# Altium project PCB-Tester-Board-V1.PrjPcb (part 3 of 4)

## Sheet X7A15T-Prog.SchDoc: PCB-Tester X7A15T-Prog
size A4; Organization: Test Engineering; Address1: Hans-Bunte-Strasse 19; Address2: D-79108 Freiburg; Address3: Germany; DocumentNumber: U33110; Revision: V1.0; SheetNumber: 12; SheetTotal: 20; Date: JUN 2020; CheckedBy: Moerz, Hoeren; Author: Rudziński; CompanyName: TDK-Micronas GmbH; DrawnBy: Rudziński; Engineer: Rudziński; DateDraw: JUN 2020; DateChecked: 2020-06-19; PageSetup: Record=PageOptions|CenterHorizontal=True|CenterVertical=True|PrintScale=0.97|XCorrection=1.00|YCorrection=1.00|PrintKind=0|BorderSize=5000000|LeftOffset=0|BottomOffset=0|Orientation=2|PaperLength=1000|PaperWidth=1000|Scale=100|PaperSource=7|PrintQuality=-3|MediaType=1|DitherType=10|PrintScaleMode=1|PaperKind=A4|PaperIndex=9; TitleTyp: Title-Typ; Block: CPU & SCT8; Workspace: Workspace
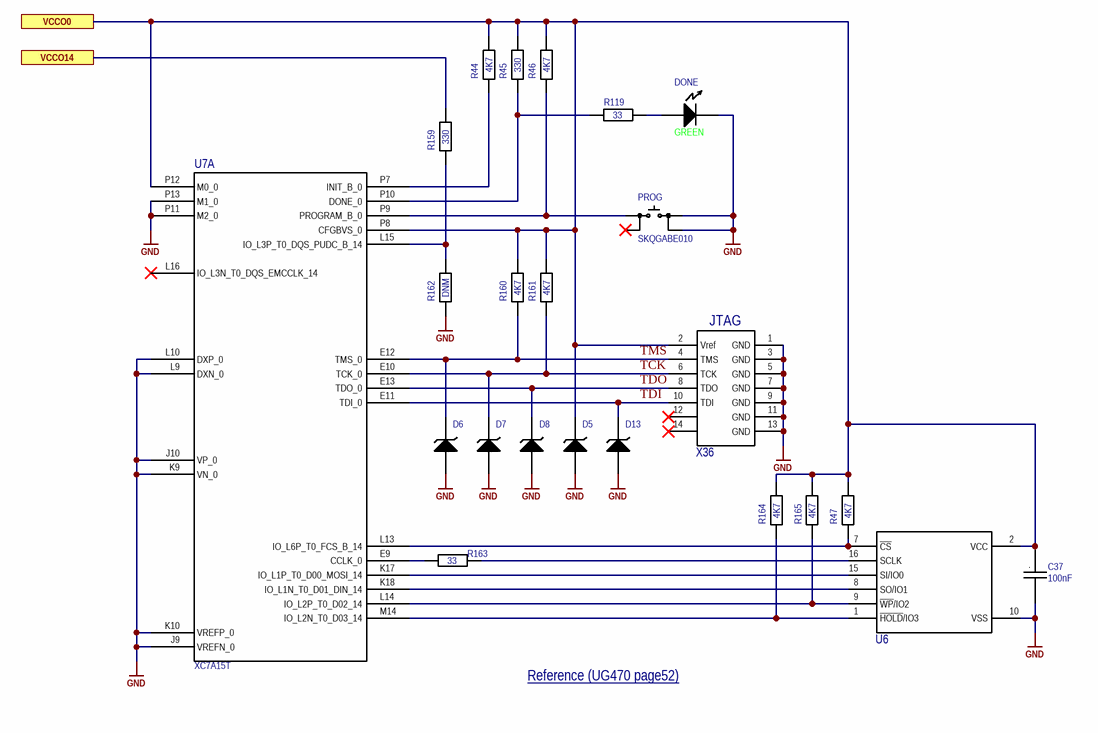
[diagram p10: X7A15T-Prog.SchDoc]

### Parts
C37  value 100nF  [C0402 Reflow]  (hidden comment: C)
D5  D  [SOD323]  (value not drawn)
D6  D  [SOD323]  (value not drawn)
D7  D  [SOD323]  (value not drawn)
D8  D  [SOD323]  (value not drawn)
D13  D  [SOD323]  (value not drawn)
DONE  Color: GREEN  [L0603G]  (hidden comment: D)
PROG  SKQGABE010  [SKQGABE010]
R44  value 4K7  [R0402 Reflow]  (hidden comment: R)
R45  value 330  [R0402 Reflow]  (hidden comment: R)
R46  value 4K7  [R0402 Reflow]  (hidden comment: R)
R47  value 4K7  [R0402 Reflow]  (hidden comment: R)
R119  value 33  [R0402 Reflow]  (hidden comment: R)
R159  value 330  [R0402 Reflow]  (hidden comment: R)
R160  value 4K7  [R0402 Reflow]  (hidden comment: R)
R161  value 4K7  [R0402 Reflow]  (hidden comment: R)
R162  value DNM  [R0402 Reflow]  (hidden comment: R)  (no BOM)
R163  value 33  [R0402 Reflow]  (hidden comment: R)
R164  value 4K7  [R0402 Reflow]  (hidden comment: R)
R165  value 4K7  [R0402 Reflow]  (hidden comment: R)
U6  U  [SOICW-16]  (value not drawn)
U7  NicName: XC7A15T  [XC7A15T-1CSG324C]  (hidden comment: U)  (part A of 8)
X36  NickName: JTAG  [LTMM-107-02-F-D]  (hidden comment: X)

### Ports
VCCO0, VCCO14

### Nets
3V3: C37.1 D5.2(C) R44.2 R45.2 R46.2 R47.2 R159.2 R160.2 R161.2 R164.2 R165.2 U6.2(VCC) U7.P8(CFGBVS_0) U7.P12(M0_0) X36.2(Vref) ; port VCCO0, port VCCO14
GND: C37.2 D5.1(A) D6.1(A) D7.1(A) D8.1(A) D13.1(A) DONE.2(Cathode) PROG.3 PROG.4 R162.1 U6.10(VSS) U7.J9(VREFN_0) U7.J10(VP_0) U7.K9(VN_0) U7.K10(VREFP_0) U7.L9(DXN_0) U7.L10(DXP_0) U7.P11(M2_0) U7.P13(M1_0) X36.1(GND) X36.3(GND) X36.5(GND) X36.7(GND) X36.9(GND) X36.11(GND) X36.13(GND)
TCK: D7.2(C) R161.1 U7.E10(TCK_0) X36.6(TCK)  [project net TCK_12]
TDI: D13.2(C) U7.E11(TDI_0) X36.10(TDI)  [project net TDI_12]
TDO: D8.2(C) U7.E13(TDO_0) X36.8(TDO)  [project net TDO_12]
TMS: D6.2(C) R160.1 U7.E12(TMS_0) X36.4(TMS)  [project net TMS_12]
NetDONE_1: DONE.1(Anode) R119.2
NetPROG_1: PROG.1 R46.1 U7.P9(PROGRAM_B_0)
NetR44_1: R44.1 U7.P7(INIT_B_0)
NetR45_1: R45.1 R119.1 U7.P10(DONE_0)
NetR47_1: R47.1 U6.7(~{CS}) U7.L13(IO_L6P_T0_FCS_B_14)
NetR159_1: R159.1 R162.2 U7.L15(IO_L3P_T0_DQS_PUDC_B_14)
NetR163_1: R163.1 U7.E9(CCLK_0)
NetR163_2: R163.2 U6.16(SCLK)
NetR164_1: R164.1 U6.1(~{HOLD}/IO3) U7.M14(IO_L2N_T0_D03_14)
NetR165_1: R165.1 U6.9(~{WP}/IO2) U7.L14(IO_L2P_T0_D02_14)
NetU6_8: U6.8(SO/IO1) U7.K18(IO_L1N_T0_D01_DIN_14)
NetU6_15: U6.15(SI/IO0) U7.K17(IO_L1P_T0_D00_MOSI_14)

Not connected (* = marked no-connect by the designer): PROG 2*; U7 L16(IO_L3N_T0_DQS_EMCCLK_14)*; X36 12* 14*

### Notes on the sheet
- Reference (UG470 page52) <https://www.xilinx.com/support/documentation/user_guides/ug470_7Series_Config.pdf>
- designed by
- reviewed by
- last drawn by
- Project:
- Schematic:
- last printed
- DIN-A4 L
- sheets
- of
- File:
- (in symbol C) .

### Library data of the parts
C37 = C: CAP CER 0.1UF 25V X7R 0402; 04. Manufacturer: Yageo; 07. Manufacturer  Part Number: CC0402KRX7R8BB104; Tolerance: ±5%; Voltage Rating: 16V; 03. Unit Price: 0.09; 13. Created Date/Name: AUG2018/Hören; Type: X7R; ComponentLink1Description: Info; ComponentLink1URL: https://www.digikey.de/product-detail/en/kemet/C0402C104J4RACTU/399-7761-6-ND/3472292; 02. Distributor Part Number: 311-2077-6-ND; 09. Operating Temperature: -55°C ~ 125°C; 11. RoHS: YES; 01. Distributor: DigiKey; ComponentLink2Description: DataSheet; ComponentLink2URL: https://content.kemet.com/datasheets/KEM_C1002_X7R_SMD.pdf; Package: 0402
D5-D8 D13 = UCLAMP3301D.TCT: TVS DIODE 3.3V 9.5V SOD323; 04. Manufacturer: Semtech Corporation; 03. Unit Price: 0.67; 01. Distributor: DigiKey; 02. Distributor Part Number: UCLAMP3301DCT-ND; 07. Manufacturer  Part Number: UCLAMP3301D.TCT; 11. RoHS: YES; ComponentLink1Description: Info; ComponentLink1URL: https://www.digikey.de/product-detail/en/nexperia-usa-inc/PMEG4050EP115/1727-5842-6-ND/2697559; ComponentLink2Description: DataSheet; ComponentLink2URL: https://assets.nexperia.com/documents/data-sheet/PMEG4050EP.pdf
DONE = LED: LED GREEN DIFFUSED 0603 SMD; 04. Manufacturer: OSRAM Opto Semiconductors Inc.; 07. Manufacturer  Part Number: LG L29K-G2J1-24-Z; Vf: 1.7V; If: 2mA; Wave Length: 570nm; Viewing Angle: 160°; 03. Unit Price: 0.4; 13. Created Date/Name: AUG2018/Hören; ComponentLink1Description: Info; ComponentLink1URL: https://www.digikey.de/products/en?keywords=475-2709-6-ND; ComponentLink2Description: DataSheet; ComponentLink2URL: https://www.digikey.de/products/en?keywords=475-2709-6-ND; 02. Distributor Part Number: 475-2709-6-ND; 11. RoHS: YES; 01. Distributor: DigiKey
PROG = PUSH_BTN: Tactile Switches 5.2x5.2x1.5mm 160gf; 04. Manufacturer: Alps; 03. Unit Price: 0.497; ComponentLink1URL: *; ComponentLink1Description: Info; 02. Distributor Part Number: 688-SKQGAB; 07. Manufacturer  Part Number: SKQGABE010; 11. RoHS: YES; 01. Distributor: Mouser; ComponentLink2Description: DataSheet; Value: SKQGABE010
R44 R46 R47 R160 R161 R164 R165 = R: RES SMD 4.7K OHM 1% 1/16W 0402; 04. Manufacturer: Yageo; 07. Manufacturer  Part Number: RC0402FR-074K7L; 03. Unit Price: 0.09; 13. Created Date/Name: AUG2018/Hören; Power Rating: 63mW; Tolerance: ±1%; ComponentLink1URL: https://www.digikey.de/products/en?keywords=311-4.7KLRDKR-ND; ComponentLink1Description: Info; 02. Distributor Part Number: 311-4.7KLRDKR-ND; 09. Operating Temperature: -55°C ~ 155°C; 11. RoHS: YES; 01. Distributor: DigiKey; ComponentLink2Description: DataSheet; Type: Thick Film; Package: 0402
R45 R159 R162 = R: RES SMD 330 OHM 1% 1/16W 0402; 04. Manufacturer: Yageo; 07. Manufacturer  Part Number: RC0402FR-07330RL; 03. Unit Price: 0.09; 13. Created Date/Name: AUG2018/Hören; Power Rating: 63mW; Tolerance: ±1%; ComponentLink1URL: https://www.digikey.de/products/en?keywords=311-330LRDKR-ND; ComponentLink1Description: Info; 02. Distributor Part Number: 311-330LRDKR-ND; 09. Operating Temperature: -55°C ~ 155°C; 11. RoHS: YES; 01. Distributor: DigiKey; ComponentLink2Description: DataSheet; Type: Thick Film; Package: 0402
R119 R163 = R_19: RES SMD 33 OHM 1% 1/16W 0402; 04. Manufacturer: Yageo; 07. Manufacturer  Part Number: RC0402FR-0733RL; 03. Unit Price: 0.09; 13. Created Date/Name: AUG2018/Hören; Power Rating: 63mW; Tolerance: ±1%; ComponentLink1URL: https://www.digikey.de/products/en?keywords=311-33.0LRDKR-ND; ComponentLink1Description: Info; 02. Distributor Part Number: 311-33.0LRDKR-ND; 09. Operating Temperature: -55°C ~ 155°C; 11. RoHS: YES; 01. Distributor: DigiKey; ComponentLink2Description: DataSheet; Type: Thick Film; Package: 0402
U6 = S25FL128SAGMFI000: IC FLASH 128M SPI 133MHZ 16SOIC; 04. Manufacturer: Cypress Semiconductor Corp; 03. Unit Price: 2.77; 01. Distributor: Digikey; 02. Distributor Part Number: 1274-1000-ND; 07. Manufacturer  Part Number: S25FL128SAGMFI000; ComponentLink2Description: DataSheet; NickName: S25FL128SAGMFI000
U7 = XC7A15T-CS324: XC7A15T-1CSG324C; MFR: XILINX; POPULATED: yes; 03. Unit Price: 20.65; MFR-PN: XC7A15T-CS324; 04. Manufacturer: XILINX; 07. Manufacturer  Part Number: XC7A15T-1CSG324C; 01. Distributor: Avnet; 02. Distributor Part Number: XC7A15T-1CSG324C; 09. Operating Temperature: 0°C ~ 85°C (TJ); 11. RoHS: YES; ComponentLink4Description: Info; ComponentLink4URL: https://www.digikey.de/products/en?keywords=XC7A15T-1CSG324C; ComponentLink5Description: DataSheet; ComponentLink5URL: https://www.xilinx.com/support/documentation/data_sheets/ds181_Artix_7_Data_Sheet.pdf; ComponentLink6Description: NXP; ComponentLink6URL: https://www.nxp.com/part/MK20DN512VMD10
X36 = LTMM-107-02-F-D: CONN HEADER VERT 14POS 2MM; 04. Manufacturer: Samtec Inc.; 03. Unit Price: 2.38; 13. Created Date/Name: ??? / Hören; System: Connector; 01. Distributor: DigiKey; 02. Distributor Part Number: LTMM-107-02-F-D-ND; 07. Manufacturer  Part Number: LTMM-107-02-F-D; 11. RoHS: YES; ComponentLink1Description: Info; ComponentLink1URL: https://www.digikey.de/product-detail/en/samtec-inc/LTMM-107-02-F-D/LTMM-107-02-F-D-ND/8723899; ComponentLink2Description: DataSheet; ComponentLink2URL: https://www.samtec.com/products/ltmm

## Sheet X7A15T-Fabric.SchDoc: PCB-Tester X7A15T-Fabric
size A3; Organization: Test Engineering; Address1: Hans-Bunte-Strasse 19; Address2: D-79108 Freiburg; Address3: Germany; DocumentNumber: U33110; Revision: V1.0; SheetNumber: 9; SheetTotal: 20; Date: JUN 2020; CheckedBy: Moerz, Hoeren; Author: Rudziński; CompanyName: TDK-Micronas GmbH; DrawnBy: Rudziński; Engineer: Rudziński; DateDraw: JUN 2020; DateChecked: 2020-06-19; PageSetup: Record=PageOptions|CenterHorizontal=True|CenterVertical=True|PrintScale=0.97|XCorrection=1.00|YCorrection=1.00|PrintKind=0|BorderSize=5000000|LeftOffset=0|BottomOffset=0|Orientation=2|PaperLength=1000|PaperWidth=1000|Scale=100|PaperSource=7|PrintQuality=-3|MediaType=1|DitherType=10|PrintScaleMode=1|PaperKind=A4|PaperIndex=9; TitleTyp: Title-Typ; Block: CPU & SCT8; Workspace: Workspace
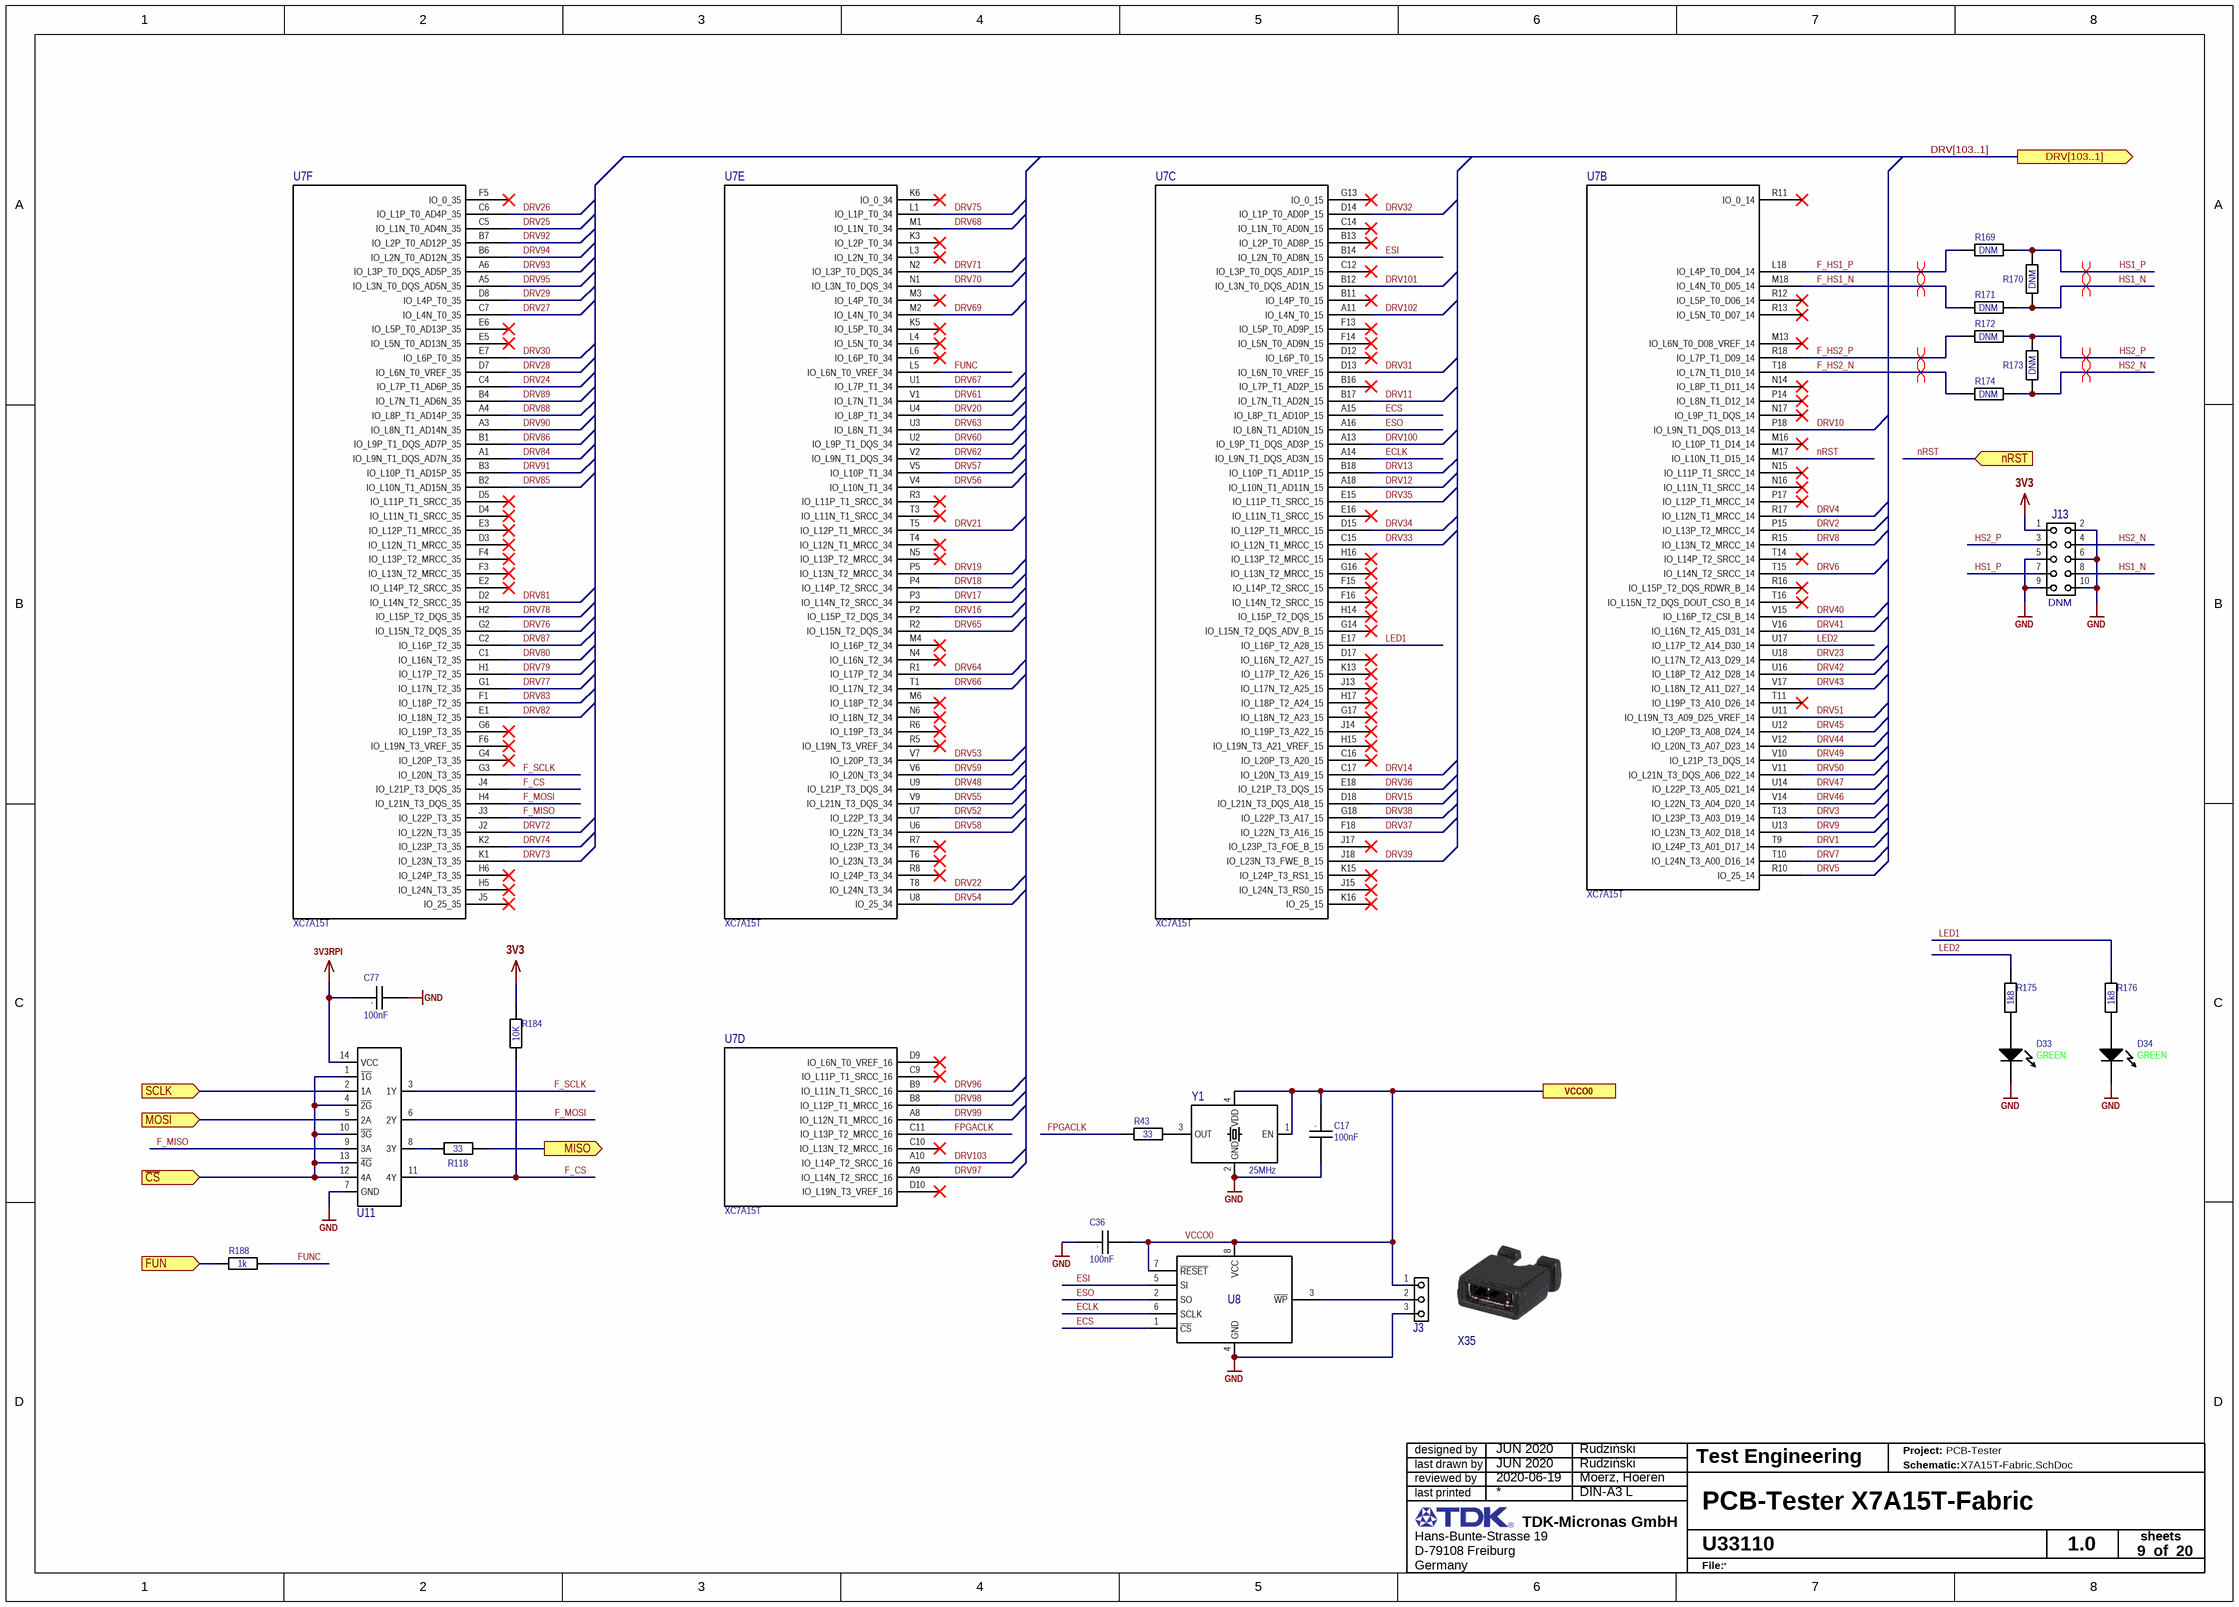
[diagram p11: X7A15T-Fabric.SchDoc]

### Parts
C17  value 100nF  [C0402 Reflow]  (hidden comment: C)
C36  value 100nF  [C0402 Reflow]  (hidden comment: C)
C77  value 100nF  [C0402 Reflow]  (hidden comment: C)
D33  Color: GREEN  [L0603G]  (hidden comment: D)
D34  Color: GREEN  [L0603G]  (hidden comment: D)
J3  J  [Header 100mil 3x1]  (value not drawn)
J13  NicName: DNM  [Header 100mil 5x2]  (hidden comment: J)  (no BOM)
R43  value 33  [R0402 Reflow]  (hidden comment: R)
R118  value 33  [R0402 Reflow]  (hidden comment: R)
R169  value DNM  [R0402 Reflow]  (hidden comment: R)  (no BOM)
R170  value DNM  [R0402 Reflow]  (hidden comment: R)  (no BOM)
R171  value DNM  [R0402 Reflow]  (hidden comment: R)  (no BOM)
R172  value DNM  [R0402 Reflow]  (hidden comment: R)  (no BOM)
R173  value DNM  [R0402 Reflow]  (hidden comment: R)  (no BOM)
R174  value DNM  [R0402 Reflow]  (hidden comment: R)  (no BOM)
R175  value 1k8  [R0603 Reflow]  (hidden comment: R)
R176  value 1k8  [R0603 Reflow]  (hidden comment: R)
R184  value 10K  [R0402 Reflow]  (hidden comment: R)
R188  value 1k  [R0402 Reflow]  (hidden comment: R)
U7  NicName: XC7A15T  [XC7A15T-1CSG324C]  (hidden comment: U)  (parts B,C,D,E,F of 8)
U8  U  [SOIC8 (R-8)]  (value not drawn)
U11  U  [TSSOP14]  (value not drawn)
X35  X  (value not drawn)
Y1  Frequency: 25MHz  [4SMD]  (hidden comment: Y)

### Ports
DRV[103..1] (out), FUN (in), MISO (out), MOSI (in), nRST (in), SCLK (in), VCCO0, ~{CS} (in)

### Nets
3V3: C17.1 C36.2 J3.1 J13.1 R184.2 U8.7(~{RESET}) U8.8(VCC) Y1.1(EN) Y1.4(VDD) ; port VCCO0  [also labelled VCCO0]
3V3RPI: C77.1 U11.14(VCC)
GND: C17.2 C36.1 C77.2 D33.2(Cathode) D34.2(Cathode) J3.3 J13.2 J13.5 J13.6 J13.9 J13.10 U8.4(GND) U11.7(GND) Y1.2(GND)
~{CS1}: U11.1(~{1G}) U11.4(~{2G}) U11.10(~{3G}) U11.12(4A) U11.13(~{4G}) ; port ~{CS}
DRV1: U7.T9(IO_L24P_T3_A01_D17_14)
DRV2: U7.P15(IO_L13P_T2_MRCC_14)
DRV3: U7.T13(IO_L23P_T3_A03_D19_14)
DRV4: U7.R17(IO_L12N_T1_MRCC_14)
DRV5: U7.R10(IO_25_14)
DRV6: U7.T15(IO_L14N_T2_SRCC_14)
DRV7: U7.T10(IO_L24N_T3_A00_D16_14)
DRV8: U7.R15(IO_L13N_T2_MRCC_14)
DRV9: U7.U13(IO_L23N_T3_A02_D18_14)
DRV10: U7.P18(IO_L9N_T1_DQS_D13_14)
DRV11: U7.B17(IO_L7N_T1_AD2N_15)
DRV12: U7.A18(IO_L10N_T1_AD11N_15)
DRV13: U7.B18(IO_L10P_T1_AD11P_15)
DRV14: U7.C17(IO_L20N_T3_A19_15)
DRV15: U7.D18(IO_L21N_T3_DQS_A18_15)
DRV16: U7.P2(IO_L15P_T2_DQS_34)
DRV17: U7.P3(IO_L14N_T2_SRCC_34)
DRV18: U7.P4(IO_L14P_T2_SRCC_34)
DRV19: U7.P5(IO_L13N_T2_MRCC_34)
DRV20: U7.U4(IO_L8P_T1_34)
DRV21: U7.T5(IO_L12P_T1_MRCC_34)
DRV22: U7.T8(IO_L24N_T3_34)
DRV23: U7.U18(IO_L17N_T2_A13_D29_14)
DRV24: U7.C4(IO_L7P_T1_AD6P_35)
DRV25: U7.C5(IO_L1N_T0_AD4N_35)
DRV26: U7.C6(IO_L1P_T0_AD4P_35)
DRV27: U7.C7(IO_L4N_T0_35)
DRV28: U7.D7(IO_L6N_T0_VREF_35)
DRV29: U7.D8(IO_L4P_T0_35)
DRV30: U7.E7(IO_L6P_T0_35)
DRV31: U7.D13(IO_L6N_T0_VREF_15)
DRV32: U7.D14(IO_L1P_T0_AD0P_15)
DRV33: U7.C15(IO_L12N_T1_MRCC_15)
DRV34: U7.D15(IO_L12P_T1_MRCC_15)
DRV35: U7.E15(IO_L11P_T1_SRCC_15)
DRV36: U7.E18(IO_L21P_T3_DQS_15)
DRV37: U7.F18(IO_L22N_T3_A16_15)
DRV38: U7.G18(IO_L22P_T3_A17_15)
DRV39: U7.J18(IO_L23N_T3_FWE_B_15)
DRV40: U7.V15(IO_L16P_T2_CSI_B_14)
DRV41: U7.V16(IO_L16N_T2_A15_D31_14)
DRV42: U7.U16(IO_L18P_T2_A12_D28_14)
DRV43: U7.V17(IO_L18N_T2_A11_D27_14)
DRV44: U7.V12(IO_L20N_T3_A07_D23_14)
DRV45: U7.U12(IO_L20P_T3_A08_D24_14)
DRV46: U7.V14(IO_L22N_T3_A04_D20_14)
DRV47: U7.U14(IO_L22P_T3_A05_D21_14)
DRV48: U7.U9(IO_L21P_T3_DQS_34)
DRV49: U7.V10(IO_L21P_T3_DQS_14)
DRV50: U7.V11(IO_L21N_T3_DQS_A06_D22_14)
DRV51: U7.U11(IO_L19N_T3_A09_D25_VREF_14)
DRV52: U7.U7(IO_L22P_T3_34)
DRV53: U7.V7(IO_L20P_T3_34)
DRV54: U7.U8(IO_25_34)
DRV55: U7.V9(IO_L21N_T3_DQS_34)
DRV56: U7.V4(IO_L10N_T1_34)
DRV57: U7.V5(IO_L10P_T1_34)
DRV58: U7.U6(IO_L22N_T3_34)
DRV59: U7.V6(IO_L20N_T3_34)
DRV60: U7.U2(IO_L9P_T1_DQS_34)
DRV61: U7.V1(IO_L7N_T1_34)
DRV62: U7.V2(IO_L9N_T1_DQS_34)
DRV63: U7.U3(IO_L8N_T1_34)
DRV64: U7.R1(IO_L17P_T2_34)
DRV65: U7.R2(IO_L15N_T2_DQS_34)
DRV66: U7.T1(IO_L17N_T2_34)
DRV67: U7.U1(IO_L7P_T1_34)
DRV68: U7.M1(IO_L1N_T0_34)
DRV69: U7.M2(IO_L4N_T0_34)
DRV70: U7.N1(IO_L3N_T0_DQS_34)
DRV71: U7.N2(IO_L3P_T0_DQS_34)
DRV72: U7.J2(IO_L22N_T3_35)
DRV73: U7.K1(IO_L23N_T3_35)
DRV74: U7.K2(IO_L23P_T3_35)
DRV75: U7.L1(IO_L1P_T0_34)
DRV76: U7.G2(IO_L15N_T2_DQS_35)
DRV77: U7.G1(IO_L17N_T2_35)
DRV78: U7.H2(IO_L15P_T2_DQS_35)
DRV79: U7.H1(IO_L17P_T2_35)
DRV80: U7.C1(IO_L16N_T2_35)
DRV81: U7.D2(IO_L14N_T2_SRCC_35)
DRV82: U7.E1(IO_L18N_T2_35)
DRV83: U7.F1(IO_L18P_T2_35)
DRV84: U7.A1(IO_L9N_T1_DQS_AD7N_35)
DRV85: U7.B2(IO_L10N_T1_AD15N_35)
DRV86: U7.B1(IO_L9P_T1_DQS_AD7P_35)
DRV87: U7.C2(IO_L16P_T2_35)
DRV88: U7.A4(IO_L8P_T1_AD14P_35)
DRV89: U7.B4(IO_L7N_T1_AD6N_35)
DRV90: U7.A3(IO_L8N_T1_AD14N_35)
DRV91: U7.B3(IO_L10P_T1_AD15P_35)
DRV92: U7.B7(IO_L2P_T0_AD12P_35)
DRV93: U7.A6(IO_L3P_T0_DQS_AD5P_35)
DRV94: U7.B6(IO_L2N_T0_AD12N_35)
DRV95: U7.A5(IO_L3N_T0_DQS_AD5N_35)
DRV96: U7.B9(IO_L11N_T1_SRCC_16)
DRV97: U7.A9(IO_L14N_T2_SRCC_16)
DRV98: U7.B8(IO_L12P_T1_MRCC_16)
DRV99: U7.A8(IO_L12N_T1_MRCC_16)
DRV100: U7.A13(IO_L9P_T1_DQS_AD3P_15)
DRV101: U7.B12(IO_L3N_T0_DQS_AD1N_15)
DRV102: U7.A11(IO_L4N_T0_15)
DRV103: U7.A10(IO_L14P_T2_SRCC_16)
ECLK: U7.A14(IO_L9N_T1_DQS_AD3N_15) U8.6(SCLK)  [project net ECLK_9]
ECS: U7.A15(IO_L8P_T1_AD10P_15) U8.1(~{CS})  [project net ECS_9]
ESI: U7.B14(IO_L2N_T0_AD8N_15) U8.5(SI)  [project net ESI_9]
ESO: U7.A16(IO_L8N_T1_AD10N_15) U8.2(SO)  [project net ESO_9]
F_CS: R184.1 U7.J4(IO_L21P_T3_DQS_35) U11.11(4Y)  [project net F_CS_9]
F_HS1_N: R171.1 U7.M18(IO_L4N_T0_D05_14)  [project net F_HS1_N_9]
F_HS1_P: R169.1 U7.L18(IO_L4P_T0_D04_14)  [project net F_HS1_P_9]
F_HS2_N: R174.1 U7.T18(IO_L7N_T1_D10_14)  [project net F_HS2_N_9]
F_HS2_P: R172.1 U7.R18(IO_L7P_T1_D09_14)  [project net F_HS2_P_9]
F_MISO: U7.J3(IO_L22P_T3_35) U11.9(3A)  [project net F_MISO_9]
F_MOSI: U7.H4(IO_L21N_T3_DQS_35) U11.6(2Y)  [project net F_MOSI_9]
F_SCLK: U7.G3(IO_L20N_T3_35) U11.3(1Y)  [project net F_SCLK_9]
FPGACLK: R43.2 U7.C11(IO_L13P_T2_MRCC_16)  [project net FPGACLK_9]
FUN: R188.2 ; port FUN
FUNC: R188.1 U7.L5(IO_L6N_T0_VREF_34)  [project net FUNC_9]
HS1_N: J13.8 R170.1 R171.2  [project net HS1_N_9]
HS1_P: J13.7 R169.2 R170.2  [project net HS1_P_9]
HS2_N: J13.4 R173.1 R174.2  [project net HS2_N_9]
HS2_P: J13.3 R172.2 R173.2  [project net HS2_P_9]
LED1: R176.2 U7.E17(IO_L16P_T2_A28_15)  [project net LED1_9]
LED2: R175.2 U7.U17(IO_L17P_T2_A14_D30_14)  [project net LED2_9]
MISO: R118.1 ; port MISO
MOSI: U11.5(2A) ; port MOSI
nRST: U7.M17(IO_L10N_T1_D15_14) ; port nRST
SCLK: U11.2(1A) ; port SCLK
NetD33_1: D33.1(Anode) R175.1
NetD34_1: D34.1(Anode) R176.1
NetJ3_2: J3.2 U8.3(~{WP})
NetR43_1: R43.1 Y1.3(OUT)
NetR118_2: R118.2 U11.8(3Y)

Not connected (* = marked no-connect by the designer): U7 B11(IO_L4P_T0_15)* B13(IO_L2P_T0_AD8P_15)* B16(IO_L7P_T1_AD2P_15)* C9(IO_L11P_T1_SRCC_16)* C10(IO_L13N_T2_MRCC_16)* C12(IO_L3P_T0_DQS_AD1P_15)* C14(IO_L1N_T0_AD0N_15)* C16(IO_L20P_T3_A20_15)* D3(IO_L12N_T1_MRCC_35)* D4(IO_L11N_T1_SRCC_35)* D5(IO_L11P_T1_SRCC_35)* D9(IO_L6N_T0_VREF_16)* D10(IO_L19N_T3_VREF_16)* D12(IO_L6P_T0_15)* D17(IO_L16N_T2_A27_15)* E2(IO_L14P_T2_SRCC_35)* E3(IO_L12P_T1_MRCC_35)* E5(IO_L5N_T0_AD13N_35)* E6(IO_L5P_T0_AD13P_35)* E16(IO_L11N_T1_SRCC_15)* F3(IO_L13N_T2_MRCC_35)* F4(IO_L13P_T2_MRCC_35)* F5(IO_0_35)* F6(IO_L19N_T3_VREF_35)* F13(IO_L5P_T0_AD9P_15)* F14(IO_L5N_T0_AD9N_15)* F15(IO_L14P_T2_SRCC_15)* F16(IO_L14N_T2_SRCC_15)* G4(IO_L20P_T3_35)* G6(IO_L19P_T3_35)* G13(IO_0_15)* G14(IO_L15N_T2_DQS_ADV_B_15)* G16(IO_L13N_T2_MRCC_15)* G17(IO_L18N_T2_A23_15)* H5(IO_L24N_T3_35)* H6(IO_L24P_T3_35)* H14(IO_L15P_T2_DQS_15)* H15(IO_L19N_T3_A21_VREF_15)* H16(IO_L13P_T2_MRCC_15)* H17(IO_L18P_T2_A24_15)* J5(IO_25_35)* J13(IO_L17N_T2_A25_15)* J14(IO_L19P_T3_A22_15)* J15(IO_L24N_T3_RS0_15)* J17(IO_L23P_T3_FOE_B_15)* K3(IO_L2P_T0_34)* K5(IO_L5P_T0_34)* K6(IO_0_34)* K13(IO_L17P_T2_A26_15)* K15(IO_L24P_T3_RS1_15)* K16(IO_25_15)* L3(IO_L2N_T0_34)* L4(IO_L5N_T0_34)* L6(IO_L6P_T0_34)* M3(IO_L4P_T0_34)* M4(IO_L16P_T2_34)* M6(IO_L18P_T2_34)* M13(IO_L6N_T0_D08_VREF_14)* M16(IO_L10P_T1_D14_14)* N4(IO_L16N_T2_34)* N5(IO_L13P_T2_MRCC_34)* N6(IO_L18N_T2_34)* N14(IO_L8P_T1_D11_14)* N15(IO_L11P_T1_SRCC_14)* N16(IO_L11N_T1_SRCC_14)* N17(IO_L9P_T1_DQS_14)* P14(IO_L8N_T1_D12_14)* P17(IO_L12P_T1_MRCC_14)* R3(IO_L11P_T1_SRCC_34)* R5(IO_L19N_T3_VREF_34)* R6(IO_L19P_T3_34)* R7(IO_L23P_T3_34)* R8(IO_L24P_T3_34)* R11(IO_0_14)* R12(IO_L5P_T0_D06_14)* R13(IO_L5N_T0_D07_14)* R16(IO_L15P_T2_DQS_RDWR_B_14)* T3(IO_L11N_T1_SRCC_34)* T4(IO_L12N_T1_MRCC_34)* T6(IO_L23N_T3_34)* T11(IO_L19P_T3_A10_D26_14)* T14(IO_L14P_T2_SRCC_14)* T16(IO_L15N_T2_DQS_DOUT_CSO_B_14)*

### Buses and harness runs
bus DRV[103..1] = port DRV[103..1]

### Layout directives
differential pair; net class GENHS_DP: F_HS1_N_9, F_HS1_P_9, F_HS2_N_9, F_HS2_P_9, HS1_N_9, HS1_P_9, HS2_N_9, HS2_P_9

### Notes on the sheet
- designed by
- reviewed by
- last drawn by
- Project:
- Schematic:
- last printed
- DIN-A3 L
- sheets
- of
- File:
- (in symbol C) .

### Library data of the parts
C17 C36 C77 = C: as C37 on sheet X7A15T-Prog; Type: X7R; ComponentLink1Description: Info; ComponentLink1URL: https://www.digikey.de/product-detail/en/kemet/C0402C104J4RACTU/399-7761-6-ND/3472292; 02. Distributor Part Number: 311-2077-6-ND; 09. Operating Temperature: -55°C ~ 125°C; 11. RoHS: YES; 01. Distributor: DigiKey; ComponentLink2Description: DataSheet; ComponentLink2URL: https://content.kemet.com/datasheets/KEM_C1002_X7R_SMD.pdf; Package: 0402
D33 D34 = LED: as DONE on sheet X7A15T-Prog; ComponentLink1Description: Info; ComponentLink1URL: https://www.digikey.de/products/en?keywords=475-2709-6-ND; ComponentLink2Description: DataSheet; ComponentLink2URL: https://www.digikey.de/products/en?keywords=475-2709-6-ND; 02. Distributor Part Number: 475-2709-6-ND; 11. RoHS: YES; 01. Distributor: DigiKey
J3 = Header 3Pins 100mil: CONN HEADER VERT 3POS 2.54MM; 04. Manufacturer: Samtec Inc.; 07. Manufacturer  Part Number: HMTSW-103-07-G-S-240; 03. Unit Price: 0.25; 13. Created Date/Name: AUG2018/Hören; 01. Distributor: Samtec Inc.; 02. Distributor Part Number: HMTSW-103-07-G-S-240; 11. RoHS: YES; ComponentLink1Description: Info; ComponentLink1URL: https://www.samtec.com/products/hmtsw-103-07-g-s-240; ComponentLink2Description: DataSheet; ComponentLink2URL: http://suddendocs.samtec.com/catalog_english/hmtsw.pdf
J13 = Header 5x2Pins 100mil: 04. Manufacturer: Samtec Inc.; 07. Manufacturer  Part Number: HMTSW-103-07-G-S-240; 03. Unit Price: 0.25; 13. Created Date/Name: AUG2018/Hören; 01. Distributor: Samtec Inc.; 02. Distributor Part Number: HMTSW-103-07-G-S-240; 11. RoHS: YES; ComponentLink1Description: Info; ComponentLink1URL: https://www.samtec.com/products/hmtsw-103-07-g-s-240; ComponentLink2Description: DataSheet; ComponentLink2URL: http://suddendocs.samtec.com/catalog_english/hmtsw.pdf
R43 R118 = R: RES SMD 33 OHM 1% 1/16W 0402; 04. Manufacturer: Yageo; 07. Manufacturer  Part Number: RC0402FR-0733RL; 03. Unit Price: 0.09; 13. Created Date/Name: AUG2018/Hören; Power Rating: 63mW; Tolerance: ±1%; ComponentLink1URL: https://www.digikey.de/products/en?keywords=311-33.0LRDKR-ND; ComponentLink1Description: Info; 02. Distributor Part Number: 311-33.0LRDKR-ND; 09. Operating Temperature: -55°C ~ 155°C; 11. RoHS: YES; 01. Distributor: DigiKey; ComponentLink2Description: DataSheet; Type: Thick Film; Package: 0402
R169-R174 = R_19: as R119 on sheet X7A15T-Prog; Tolerance: ±1%; ComponentLink1URL: https://www.digikey.de/products/en?keywords=311-33.0LRDKR-ND; ComponentLink1Description: Info; 02. Distributor Part Number: 311-33.0LRDKR-ND; 09. Operating Temperature: -55°C ~ 155°C; 11. RoHS: YES; 01. Distributor: DigiKey; ComponentLink2Description: DataSheet; Type: Thick Film; Package: 0402
R175 R176 = R: RES SMD 1.8K OHM 1% 1/16W 0402; 04. Manufacturer: Yageo; 07. Manufacturer  Part Number: RC0402FR-071K8L; 03. Unit Price: 0.09; 13. Created Date/Name: AUG2018/Hören; Power Rating: 63mW; Tolerance: ±1%; ComponentLink1URL: https://www.digikey.de/product-detail/en/yageo/RC0402FR-071K65L/YAG3043DKR-ND/5282914; ComponentLink1Description: Info; 02. Distributor Part Number: 311-1.80KLRCT-ND; 09. Operating Temperature: -55°C ~ 155°C; 11. RoHS: YES; 01. Distributor: DigiKey; ComponentLink2Description: DataSheet; Type: Thick Film; Package: 0402
R184 = R_10: RES SMD 10K OHM 1% 1/16W 0402; 04. Manufacturer: Yageo; 07. Manufacturer  Part Number: RC0402FR-0710KL; 03. Unit Price: 0.09; 13. Created Date/Name: AUG2018/Hören; Power Rating: 63mW; Tolerance: ±1%; ComponentLink1URL: https://www.digikey.de/products/en?keywords=311-10.0KLRDKR-ND; ComponentLink1Description: Info; 02. Distributor Part Number: 311-10.0KLRDKR-ND; 09. Operating Temperature: -55°C ~ 155°C; 11. RoHS: YES; 01. Distributor: DigiKey; ComponentLink2Description: DataSheet; Type: Thick Film; Package: 0402
R188 = R: RES SMD 1K OHM 1% 1/16W 0402; 04. Manufacturer: Yageo; 07. Manufacturer  Part Number: RC0402FR-071KP; 03. Unit Price: 0.09; 13. Created Date/Name: AUG2018/Hören; Power Rating: 63mW; Tolerance: ±1%; ComponentLink1URL: https://www.digikey.de/products/en?keywords=311-10.0KLRDKR-ND; ComponentLink1Description: Info; 02. Distributor Part Number: YAG1254CT-ND; 09. Operating Temperature: -55°C ~ 155°C; 11. RoHS: YES; 01. Distributor: DigiKey; ComponentLink2Description: DataSheet; Type: Thick Film; Package: 0402
U7 = XC7A15T-CS324: as U7 on sheet X7A15T-Prog; MFR-PN: XC7A15T-CS324; 04. Manufacturer: XILINX; 07. Manufacturer  Part Number: XC7A15T-1CSG324C; 01. Distributor: Avnet; 02. Distributor Part Number: XC7A15T-1CSG324C; 09. Operating Temperature: 0°C ~ 85°C (TJ); 11. RoHS: YES; ComponentLink4Description: Info; ComponentLink4URL: https://www.digikey.de/products/en?keywords=XC7A15T-1CSG324C; ComponentLink5Description: DataSheet; ComponentLink5URL: https://www.xilinx.com/support/documentation/data_sheets/ds181_Artix_7_Data_Sheet.pdf; ComponentLink6Description: NXP; ComponentLink6URL: https://www.nxp.com/part/MK20DN512VMD10
U8 = MX25R3235FM1IH0: IC FLASH 32M SPI 80MHZ 8SOP; 04. Manufacturer: Macronix; 03. Unit Price: 0.79; 13. Created Date/Name: AUG 2018 / Hören; 01. Distributor: DigiKey; 02. Distributor Part Number: 1092-1175-ND; 07. Manufacturer  Part Number: MX25R3235FM1IH0; ComponentLink1Description: Info; ComponentLink1URL: https://www.digikey.de/product-detail/en/macronix/MX25R3235FM1IH0/1092-1175-ND/5957736; ComponentLink2Description: DataSheet; ComponentLink2URL: https://www.macronix.com/Lists/Datasheet/Attachments/7534/MX25R3235F%2c%20Wide%20Range%2c%2032Mb%2c%20v1.6.pdf
U11 = 74LCX125: IC BUF NON-INVERT 3.6V 14TSSOP; 04. Manufacturer: STMicroelectronics; 07. Manufacturer  Part Number: 74LCX125YTTR; 03. Unit Price: 0.51; 01. Distributor: DigiKey; 02. Distributor Part Number: 497-13204-1-ND; 11. RoHS: YES; ComponentLink1Description: Info; ComponentLink2Description: DataSheet; Package: TSSOP14
X35 = Jumper: CONN JUMPER SHORTING .100" GOLD; 04. Manufacturer: Sullins Connector Solutions; 07. Manufacturer  Part Number: QPC02SXGN-RC; 03. Unit Price: 0.09; 13. Created Date/Name: AUG2018/Hören; 01. Distributor: DigiKey; 02. Distributor Part Number: S9337-ND; 09. Operating Temperature: -xx..+yy°C; 11. RoHS: ???; ComponentLink1Description: Info; ComponentLink1URL: https://www.digikey.de/product-detail/en/sullins-connector-solutions/QPC02SXGN-RC/S9337-ND/2618262; ComponentLink2Description: DataSheet
Y1 = ASE-25.000MHZ-LC-T: XTAL OSC XO 25.0000MHZ CMOS SMD; 04. Manufacturer: Abracon LLC; 03. Unit Price: 1.46; 13. Created Date/Name: AUG 2018 / Hören; 01. Distributor: DigiKey; 02. Distributor Part Number: 535-9568-1-ND; 07. Manufacturer  Part Number: ASE-25.000MHZ-LC-T; 11. RoHS: YES; ComponentLink1Description: Info; ComponentLink1URL: https://www.digikey.de/products/en?keywords=535-9568-1-ND; ComponentLink2Description: DataSheet; Package: 4SMD

## Sheet X7A15T-Power.SchDoc: PCB-Tester X7A15T-Power
size A4 portrait; Organization: Test Engineering; Address1: Hans-Bunte-Strasse 19; Address2: D-79108 Freiburg; Address3: Germany; DocumentNumber: U33110; Revision: V1.0; SheetNumber: 10; SheetTotal: 20; Date: JUN 2020; CheckedBy: Moerz, Hoeren; Author: Rudziński; CompanyName: TDK-Micronas GmbH; DrawnBy: Rudziński; Engineer: Rudziński; DateDraw: JUN 2020; DateChecked: 2020-06-19; PageSetup: Record=PageOptions|CenterHorizontal=True|CenterVertical=True|PrintScale=0.97|XCorrection=1.00|YCorrection=1.00|PrintKind=0|BorderSize=5000000|LeftOffset=0|BottomOffset=0|Orientation=2|PaperLength=1000|PaperWidth=1000|Scale=100|PaperSource=7|PrintQuality=-3|MediaType=1|DitherType=10|PrintScaleMode=1|PaperKind=A4|PaperIndex=9; TitleTyp: Title-Typ; Block: CPU & SCT8; Workspace: Workspace
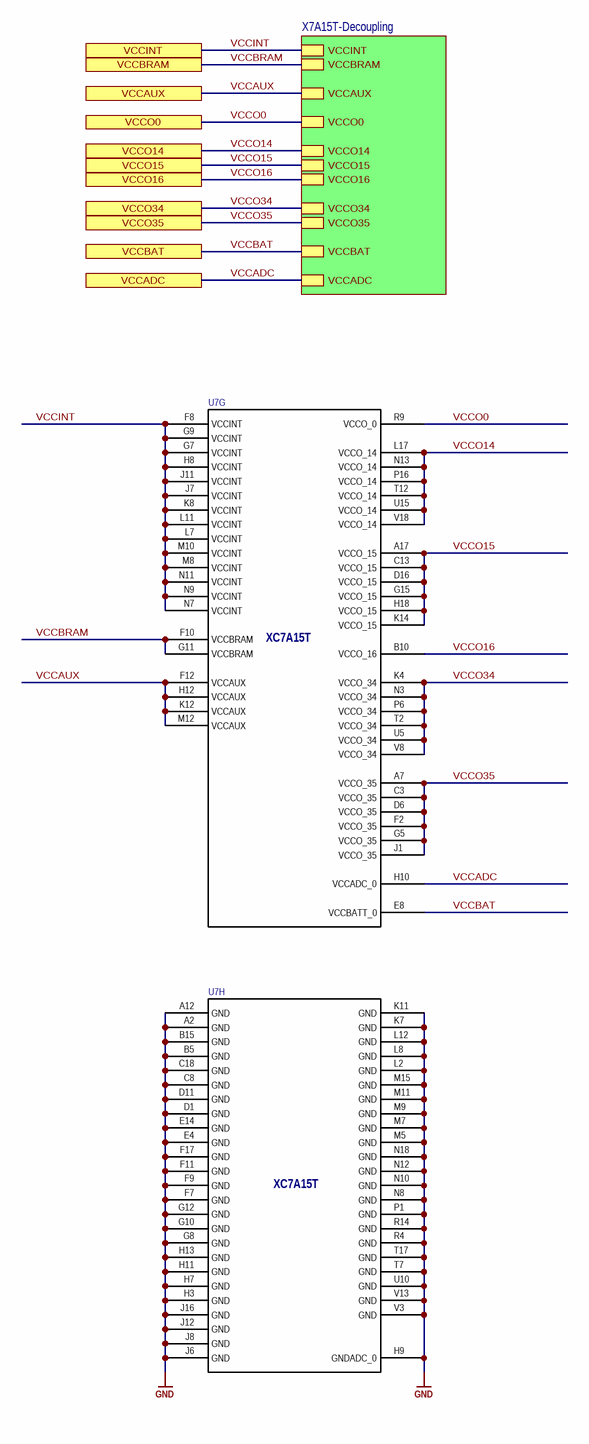
[diagram p12: X7A15T-Power.SchDoc]

### Parts
U7  NicName: XC7A15T  [XC7A15T-1CSG324C]  (hidden comment: U)  (parts G,H of 8)

### Sub-sheets
X7A15T-Decoupling = X7A15T-Decoupling.SchDoc: VCCBRAM, VCCAUX, VCCINT, VCCO34, VCCBAT, VCCO14, VCCO15, VCCO0, VCCADC, VCCO16, VCCO35

### Ports
VCCADC, VCCAUX, VCCBAT, VCCBRAM, VCCINT, VCCO0, VCCO14, VCCO15, VCCO16, VCCO34, VCCO35

### Nets
GND: U7.A2(GND) U7.A12(GND) U7.B5(GND) U7.B15(GND) U7.C8(GND) U7.C18(GND) U7.D1(GND) U7.D11(GND) U7.E4(GND) U7.E8(VCCBATT_0) U7.E14(GND) U7.F7(GND) U7.F9(GND) U7.F11(GND) U7.F17(GND) U7.G8(GND) U7.G10(GND) U7.G12(GND) U7.H3(GND) U7.H7(GND) U7.H9(GNDADC_0) U7.H11(GND) U7.H13(GND) U7.J6(GND) U7.J8(GND) U7.J12(GND) U7.J16(GND) U7.K7(GND) U7.K11(GND) U7.L2(GND) U7.L8(GND) U7.L12(GND) U7.M5(GND) U7.M7(GND) U7.M9(GND) U7.M11(GND) U7.M15(GND) U7.N8(GND) U7.N10(GND) U7.N12(GND) U7.N18(GND) U7.P1(GND) U7.R4(GND) U7.R14(GND) U7.T7(GND) U7.T17(GND) U7.U10(GND) U7.V3(GND) U7.V13(GND) ; port VCCBAT, sheet X7A15T-Decoupling/VCCBAT  [also labelled VCCBAT]
VCCADC: U7.H10(VCCADC_0) ; port VCCADC, sheet X7A15T-Decoupling/VCCADC  [project net 1V8A]
VCCAUX: U7.F12(VCCAUX) U7.H12(VCCAUX) U7.K12(VCCAUX) U7.M12(VCCAUX) ; port VCCAUX, sheet X7A15T-Decoupling/VCCAUX  [project net 1V8]
VCCBRAM: U7.F8(VCCINT) U7.F10(VCCBRAM) U7.G7(VCCINT) U7.G9(VCCINT) U7.G11(VCCBRAM) U7.H8(VCCINT) U7.J7(VCCINT) U7.J11(VCCINT) U7.K8(VCCINT) U7.L7(VCCINT) U7.L11(VCCINT) U7.M8(VCCINT) U7.M10(VCCINT) U7.N7(VCCINT) U7.N9(VCCINT) U7.N11(VCCINT) ; port VCCINT, port VCCBRAM, sheet X7A15T-Decoupling/VCCBRAM, sheet X7A15T-Decoupling/VCCINT  [also labelled VCCINT]  [project net 1V0]
VCCO0: U7.A7(VCCO_35) U7.A17(VCCO_15) U7.B10(VCCO_16) U7.C3(VCCO_35) U7.C13(VCCO_15) U7.D6(VCCO_35) U7.D16(VCCO_15) U7.F2(VCCO_35) U7.G5(VCCO_35) U7.G15(VCCO_15) U7.H18(VCCO_15) U7.J1(VCCO_35) U7.K4(VCCO_34) U7.K14(VCCO_15) U7.L17(VCCO_14) U7.N3(VCCO_34) U7.N13(VCCO_14) U7.P6(VCCO_34) U7.P16(VCCO_14) U7.R9(VCCO_0) U7.T2(VCCO_34) U7.T12(VCCO_14) U7.U5(VCCO_34) U7.U15(VCCO_14) U7.V8(VCCO_34) U7.V18(VCCO_14) ; port VCCO0, port VCCO14, port VCCO15, port VCCO16, port VCCO34, port VCCO35, sheet X7A15T-Decoupling/VCCO34, sheet X7A15T-Decoupling/VCCO14, sheet X7A15T-Decoupling/VCCO15, sheet X7A15T-Decoupling/VCCO0, sheet X7A15T-Decoupling/VCCO16, sheet X7A15T-Decoupling/VCCO35  [also labelled VCCO14, VCCO15, VCCO16, VCCO34, VCCO35]  [project net 3V3]

### Notes on the sheet
- designed by
- reviewed by
- last drawn by
- Project:
- Schematic:
- last printed
- DIN-A4 P
- sheets
- of
- File:

### Library data of the parts
U7 = XC7A15T-CS324: as U7 on sheet X7A15T-Prog; MFR-PN: XC7A15T-CS324; 04. Manufacturer: XILINX; 07. Manufacturer  Part Number: XC7A15T-1CSG324C; 01. Distributor: Avnet; 02. Distributor Part Number: XC7A15T-1CSG324C; 09. Operating Temperature: 0°C ~ 85°C (TJ); 11. RoHS: YES; ComponentLink4Description: Info; ComponentLink4URL: https://www.digikey.de/products/en?keywords=XC7A15T-1CSG324C; ComponentLink5Description: DataSheet; ComponentLink5URL: https://www.xilinx.com/support/documentation/data_sheets/ds181_Artix_7_Data_Sheet.pdf; ComponentLink6Description: NXP; ComponentLink6URL: https://www.nxp.com/part/MK20DN512VMD10

## Sheet X7A15T-Decoupling.SchDoc: PCB-Tester X7A15T-Decoupling
size A4 portrait; Organization: Test Engineering; Address1: Hans-Bunte-Strasse 19; Address2: D-79108 Freiburg; Address3: Germany; DocumentNumber: U33110; Revision: V1.0; SheetNumber: 9; SheetTotal: 18; Date: JUN 2020; CheckedBy: Moerz, Hoeren; Author: Rudziński; CompanyName: TDK-Micronas GmbH; DrawnBy: Rudziński; Engineer: Rudziński; DateDraw: JUN 2020; DateChecked: 2020-06-19; PageSetup: Record=PageOptions|CenterHorizontal=True|CenterVertical=True|PrintScale=0.97|XCorrection=1.00|YCorrection=1.00|PrintKind=0|BorderSize=5000000|LeftOffset=0|BottomOffset=0|Orientation=2|PaperLength=1000|PaperWidth=1000|Scale=100|PaperSource=7|PrintQuality=-3|MediaType=1|DitherType=10|PrintScaleMode=1|PaperKind=A4|PaperIndex=9; TitleTyp: Title-Typ; Block: CPU & SCT8; Workspace: Workspace
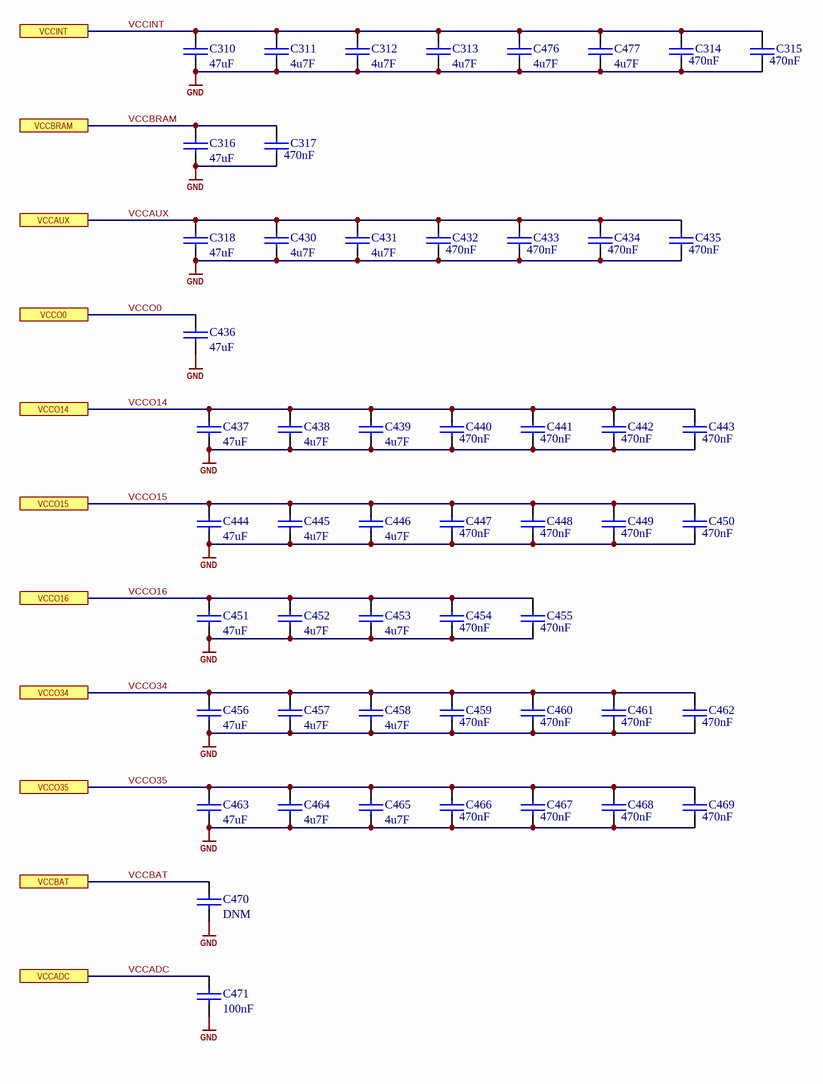
[diagram p13: X7A15T-Decoupling.SchDoc]

### Parts
C310  value 47uF  [C0805 Reflow]  (hidden comment: C)
C311  value 4u7F  [C0402 Reflow]  (hidden comment: C)
C312  value 4u7F  [C0402 Reflow]  (hidden comment: C)
C313  value 4u7F  [C0402 Reflow]  (hidden comment: C)
C314  value 470nF  [C0402 Reflow]  (hidden comment: C)
C315  value 470nF  [C0402 Reflow]  (hidden comment: C)
C316  value 47uF  [C0805 Reflow]  (hidden comment: C)
C317  value 470nF  [C0402 Reflow]  (hidden comment: C)
C318  value 47uF  [C0805 Reflow]  (hidden comment: C)
C430  value 4u7F  [C0402 Reflow]  (hidden comment: C)
C431  value 4u7F  [C0402 Reflow]  (hidden comment: C)
C432  value 470nF  [C0402 Reflow]  (hidden comment: C)
C433  value 470nF  [C0402 Reflow]  (hidden comment: C)
C434  value 470nF  [C0402 Reflow]  (hidden comment: C)
C435  value 470nF  [C0402 Reflow]  (hidden comment: C)
C436  value 47uF  [C0805 Reflow]  (hidden comment: C)
C437  value 47uF  [C0805 Reflow]  (hidden comment: C)
C438  value 4u7F  [C0402 Reflow]  (hidden comment: C)
C439  value 4u7F  [C0402 Reflow]  (hidden comment: C)
C440  value 470nF  [C0402 Reflow]  (hidden comment: C)
C441  value 470nF  [C0402 Reflow]  (hidden comment: C)
C442  value 470nF  [C0402 Reflow]  (hidden comment: C)
C443  value 470nF  [C0402 Reflow]  (hidden comment: C)
C444  value 47uF  [C0805 Reflow]  (hidden comment: C)
C445  value 4u7F  [C0402 Reflow]  (hidden comment: C)
C446  value 4u7F  [C0402 Reflow]  (hidden comment: C)
C447  value 470nF  [C0402 Reflow]  (hidden comment: C)
C448  value 470nF  [C0402 Reflow]  (hidden comment: C)
C449  value 470nF  [C0402 Reflow]  (hidden comment: C)
C450  value 470nF  [C0402 Reflow]  (hidden comment: C)
C451  value 47uF  [C0805 Reflow]  (hidden comment: C)
C452  value 4u7F  [C0402 Reflow]  (hidden comment: C)
C453  value 4u7F  [C0402 Reflow]  (hidden comment: C)
C454  value 470nF  [C0402 Reflow]  (hidden comment: C)
C455  value 470nF  [C0402 Reflow]  (hidden comment: C)
C456  value 47uF  [C0805 Reflow]  (hidden comment: C)
C457  value 4u7F  [C0402 Reflow]  (hidden comment: C)
C458  value 4u7F  [C0402 Reflow]  (hidden comment: C)
C459  value 470nF  [C0402 Reflow]  (hidden comment: C)
C460  value 470nF  [C0402 Reflow]  (hidden comment: C)
C461  value 470nF  [C0402 Reflow]  (hidden comment: C)
C462  value 470nF  [C0402 Reflow]  (hidden comment: C)
C463  value 47uF  [C0805 Reflow]  (hidden comment: C)
C464  value 4u7F  [C0402 Reflow]  (hidden comment: C)
C465  value 4u7F  [C0402 Reflow]  (hidden comment: C)
C466  value 470nF  [C0402 Reflow]  (hidden comment: C)
C467  value 470nF  [C0402 Reflow]  (hidden comment: C)
C468  value 470nF  [C0402 Reflow]  (hidden comment: C)
C469  value 470nF  [C0402 Reflow]  (hidden comment: C)
C470  value DNM  [C0402 Reflow]  (hidden comment: C)  (no BOM)
C471  value 100nF  [C0402 Reflow]  (hidden comment: C)
C476  value 4u7F  [C0402 Reflow]  (hidden comment: C)
C477  value 4u7F  [C0402 Reflow]  (hidden comment: C)

### Ports
VCCADC, VCCAUX, VCCBAT, VCCBRAM, VCCINT, VCCO0, VCCO14, VCCO15, VCCO16, VCCO34, VCCO35

### Nets
GND: C310.2 C311.2 C312.2 C313.2 C314.2 C315.2 C316.2 C317.2 C318.2 C430.2 C431.2 C432.2 C433.2 C434.2 C435.2 C436.2 C437.2 C438.2 C439.2 C440.2 C441.2 C442.2 C443.2 C444.2 C445.2 C446.2 C447.2 C448.2 C449.2 C450.2 C451.2 C452.2 C453.2 C454.2 C455.2 C456.2 C457.2 C458.2 C459.2 C460.2 C461.2 C462.2 C463.2 C464.2 C465.2 C466.2 C467.2 C468.2 C469.2 C470.1 C470.2 C471.2 C476.2 C477.2 ; port VCCBAT  [also labelled VCCBAT]
VCCADC: C471.1 ; port VCCADC  [project net 1V8A]
VCCAUX: C318.1 C430.1 C431.1 C432.1 C433.1 C434.1 C435.1 ; port VCCAUX  [project net 1V8]
VCCBRAM: C310.1 C311.1 C312.1 C313.1 C314.1 C315.1 C316.1 C317.1 C476.1 C477.1 ; port VCCBRAM, port VCCINT  [also labelled VCCINT]  [project net 1V0]
VCCO0: C436.1 C437.1 C438.1 C439.1 C440.1 C441.1 C442.1 C443.1 C444.1 C445.1 C446.1 C447.1 C448.1 C449.1 C450.1 C451.1 C452.1 C453.1 C454.1 C455.1 C456.1 C457.1 C458.1 C459.1 C460.1 C461.1 C462.1 C463.1 C464.1 C465.1 C466.1 C467.1 C468.1 C469.1 ; port VCCO34, port VCCO14, port VCCO15, port VCCO0, port VCCO16, port VCCO35  [also labelled VCCO14, VCCO15, VCCO16, VCCO34, VCCO35]  [project net 3V3]

### Notes on the sheet
- designed by
- reviewed by
- last drawn by
- Project:
- Schematic:
- last printed
- DIN-A4 P
- sheets
- of
- File:

### Library data of the parts
C310 C316 C318 C436 C437 C444 C451 C456 C463 = CAP: CAP CER 47UF 10V X5R 0805; MFR-PN: GRM32ER71A476KE15L; MFR: MURATA; MFR-TYPE: GRM series; 04. Manufacturer: Murata Electronics North America; 07. Manufacturer  Part Number: GRM21BR61A476ME15L; POPULATED: yes; Parameters: X7R, 10V, 10%; 03. Unit Price: 0.67; Tolerance: ±20%; Type: X7R; 3D-Export: No; Temperature Range: -55°C ~ 85°C; 01. Distributor: DigiKey; 02. Distributor Part Number: 490-9961-6-ND; 09. Operating Temperature: -55°C ~ 85°C; 11. RoHS: YES; Voltage Rating: 10V; ComponentLink4Description: Info; ComponentLink4URL: https://www.digikey.de/product-detail/en/murata-electronics-north-america/GRM21BR61A476ME15L/490-9961-6-ND/5027050; ComponentLink5Description: DataSheet; ComponentLink5URL: https://search.murata.co.jp/Ceramy/image/img/A01X/G101/ENG/GRM21BR61A476ME15-01.pdf
C311-C313 C430 C431 C438 C439 C445 C446 C452 C453 C457 C458 C464 C465 C470 C476 C477 = CAP: CAP CER 4.7UF 6.3V X5R 0402; 04. Manufacturer: Samsung Electro-Mechanics; 07. Manufacturer  Part Number: CL05A475KQ5NRNC; POPULATED: yes; Parameters: X7R, 6V3, 10%; 03. Unit Price: 0.28; Tolerance: 10%; Type: X7R; Voltage Rating: 6V3; 3D-Export: No; Temperature Range: -40°C/+85°C; 01. Distributor: DigiKey; 02. Distributor Part Number: 1276-1481-6-ND; 09. Operating Temperature: -55°C ~ 85°C; 11. RoHS: YES; ComponentLink4Description: DataSheet; ComponentLink4URL: https://media.digikey.com/pdf/Data%20Sheets/Samsung%20PDFs/CL_Series_MLCC_ds.pdf; ComponentLink5Description: Info; ComponentLink5URL: https://www.digikey.de/product-detail/en/samsung-electro-mechanics/CL05A475KQ5NRNC/1276-1481-6-ND/3891995
C314 C315 C317 C432-C435 C440-C443 C447-C450 C454 C455 C459-C462 C466-C469 = CAP: CAP CER 0.47UF 10V X5R 0402; 04. Manufacturer: Samsung Electro-Mechanics; 07. Manufacturer  Part Number: CL05A474KP5NNNC; POPULATED: yes; Parameters: X5R, 10V, 10%; 03. Unit Price: 0.09; Tolerance: 10%; 3D-Export: No; Temperature Range: -55°C ~ 85°C; 01. Distributor: DigiKey; 02. Distributor Part Number: 1276-1173-6-ND; 09. Operating Temperature: -55°C ~ 85°C; 11. RoHS: YES; Type: X5R; Voltage Rating: 10V; ComponentLink4Description: Info; ComponentLink4URL: https://www.digikey.de/product-detail/en/samsung-electro-mechanics/CL05A474KP5NNNC/1276-1173-6-ND/3891687; ComponentLink5Description: DataSheet; ComponentLink5URL: https://media.digikey.com/pdf/Data%20Sheets/Samsung%20PDFs/CL_Series_MLCC_ds.pdf
C471 = CAP: CAP CER 0.1UF 25V X7R 0402; 04. Manufacturer: Yageo; 07. Manufacturer  Part Number: CC0402KRX7R8BB104; POPULATED: yes; Parameters: X7R, 6V3, 10%; 03. Unit Price: 0.09; Tolerance: 10%; Voltage Rating: 6V3; 3D-Export: No; Temperature Range: -40°C/+85°C; 01. Distributor: DigiKey; 02. Distributor Part Number: 311-2077-6-ND; 09. Operating Temperature: -55°C ~ 85°C; 11. RoHS: YES; Type: X7R; ComponentLink4Description: DataSheet; ComponentLink4URL: https://media.digikey.com/pdf/Data%20Sheets/Samsung%20PDFs/CL_Series_MLCC_ds.pdf; ComponentLink5Description: Info; ComponentLink5URL: https://www.digikey.de/product-detail/en/samsung-electro-mechanics/CL05A475KQ5NRNC/1276-1481-6-ND/3891995

## Sheet Input.SchDoc: PCB-Tester Input
size A4; Date: JUN 2020; CheckedBy: Moerz, Hoeren; Author: Rudziński; CompanyName: TDK-Micronas GmbH; DrawnBy: Rudziński; Engineer: Rudziński; Organization: Test Engineering; Address1: Hans-Bunte-Strasse 19; Address2: D-79108 Freiburg; Address3: Germany; DocumentNumber: U33110; Revision: V1.0; SheetNumber: 6; SheetTotal: 20; DateDraw: JUN 2020; DateChecked: 2020-06-19; Workspace: Workspace; TitleTyp: Title-Typ; PageSetup: Record=PageOptions|CenterHorizontal=True|CenterVertical=True|PrintScale=0.97|XCorrection=1.00|YCorrection=1.00|PrintKind=0|BorderSize=5000000|LeftOffset=0|BottomOffset=0|Orientation=2|PaperLength=1000|PaperWidth=1000|Scale=100|PaperSource=7|PrintQuality=-3|MediaType=1|DitherType=10|PrintScaleMode=1|PaperKind=A4|PaperIndex=9
Used 5 times, as channels Controller/Input, Controller/Input, Controller/Input, Controller/Input, Controller/Input. Parts and nets are listed once, with the designators drawn on the sheet.
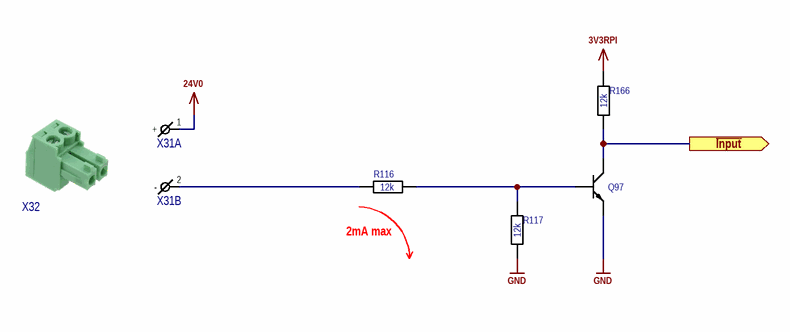
[diagram p14: Input.SchDoc]

### Parts
Q97  Q  [SOT23-3]  (value not drawn)
R116  value 12k  [R1206 Reflow]  (hidden comment: R)
R117  value 12k  [R1206 Reflow]  (hidden comment: R)
R166  value 12k  [R1206 Reflow]  (hidden comment: R)
X31  X  [691322310002]  (value not drawn)  (parts A,B of 2)
X32  X  [691361300002]  (value not drawn)

### Ports
~{Input} (out)

### Nets
3V3RPI: R166.2
24V0: X31.1(+)
GND: Q97.2(E) R117.1
~{Input}: Q97.3(C) R166.1 ; port ~{Input}
NetQ97_1: Q97.1(B) R116.2 R117.2
NetR116_1: R116.1 X31.2(-)

### Channels
Controller/Input: designators end in _1; ports ~{Input}=In1
Controller/Input: designators end in _2; ports ~{Input}=In2
Controller/Input: designators end in _3; ports ~{Input}=In3
Controller/Input: designators end in _4; ports ~{Input}=In4
Controller/Input: designators end in _5; ports ~{Input}=In5

### Notes on the sheet
- (near R116) 2mA max
- designed by
- reviewed by
- last drawn by
- Project:
- Schematic:
- last printed
- DIN-A4 L
- sheets
- of
- File:

### Library data of the parts
Q97 = NPN: MOSFET N-CH 25V 680MA SOT-23; 04. Manufacturer: ON Semiconductor; 07. Manufacturer  Part Number: FDV303N; 03. Unit Price: 0.41; 13. Created Date/Name: AUG 2018 / Hören; Rds On: 450 mΩ @ id=500mA & Vgs=4.5V; Vgs,th: 1.5V @ 250uA; Power Rating: 350mW; 3D-Export: No; 01. Distributor: DigiKey; 02. Distributor Part Number: FDV303NDKR-ND; 09. Operating Temperature: -55°C ~ 150°C (TJ); 11. RoHS: YES; ComponentLink1Description: Info; ComponentLink1URL: https://www.digikey.de/product-detail/en/on-semiconductor/FDV303N/FDV303NDKR-ND/1630434; ComponentLink2Description: DataSheet; ComponentLink2URL: https://media.digikey.com/pdf/Data%20Sheets/Fairchild%20PDFs/FDV303N.pdf; Vdss: 25V; Id: 680mA
R116 R117 R166 = R_23: RES SMD 12K OHM 1% 1/4W 1206; 04. Manufacturer: Yageo; 07. Manufacturer  Part Number: RC1206FR-0712KL; 03. Unit Price: 0.00755; Tolerance: ±1%; ComponentLink1URL: *; ComponentLink1Description: Info; 02. Distributor Part Number: 311-12.0KFRTR-ND; 11. RoHS: YES; 01. Distributor: DigiKey; ComponentLink2Description: DataSheet; Package: 1206
X31 = 691322310002: TERM BLOCK HDR 2POS 90DEG 3.81MM; 04. Manufacturer: Würth Elektronik; 03. Unit Price: 0.32; 13. Created Date/Name: ??? / Hören; System: Connector; 01. Distributor: DigiKey; 02. Distributor Part Number: 732-2088-ND; 07. Manufacturer  Part Number: 691322310002; 11. RoHS: YES; ComponentLink1Description: Info; ComponentLink1URL: https://www.digikey.de/products/en?keywords=691322310002; ComponentLink2Description: DataSheet; ComponentLink2URL: https://media.digikey.com/pdf/Data%20Sheets/Wurth%20Electronics%20PDFs/Terminal%20Blocks%20WR-TBL.pdf
X32 = 691361300002: TERM BLOCK PLUG 2POS STR 3.81MM; 04. Manufacturer: Würth Elektronik; 03. Unit Price: 1.1; 13. Created Date/Name: ??? / Hören; System: Connector; 01. Distributor: DigiKey; 02. Distributor Part Number: 732-2076-ND; 07. Manufacturer  Part Number: 691361300002; ComponentLink1Description: Info; ComponentLink1URL: https://www.digikey.de/products/en?keywords=691361300002; ComponentLink2Description: DataSheet; ComponentLink2URL: https://media.digikey.com/pdf/Data%20Sheets/Wurth%20Electronics%20PDFs/Terminal%20Blocks%20WR-TBL.pdf

## Sheet Output.SchDoc: PCB-Tester Output
size A4; Date: JUN 2020; CheckedBy: Moerz, Hoeren; Author: Rudziński; CompanyName: TDK-Micronas GmbH; DrawnBy: Rudziński; Engineer: Rudziński; Organization: Test Engineering; Address1: Hans-Bunte-Strasse 19; Address2: D-79108 Freiburg; Address3: Germany; DocumentNumber: U33110; Revision: V1.0; SheetNumber: 7; SheetTotal: 20; DateDraw: JUN 2020; DateChecked: 2020-06-19; Workspace: Workspace; TitleTyp: Title-Typ; PageSetup: Record=PageOptions|CenterHorizontal=True|CenterVertical=True|PrintScale=0.97|XCorrection=1.00|YCorrection=1.00|PrintKind=0|BorderSize=5000000|LeftOffset=0|BottomOffset=0|Orientation=2|PaperLength=1000|PaperWidth=1000|Scale=100|PaperSource=7|PrintQuality=-3|MediaType=1|DitherType=10|PrintScaleMode=1|PaperKind=A4|PaperIndex=9
Used 5 times, as channels Controller/Output, Controller/Output, Controller/Output, Controller/Output, Controller/Output. Parts and nets are listed once, with the designators drawn on the sheet.
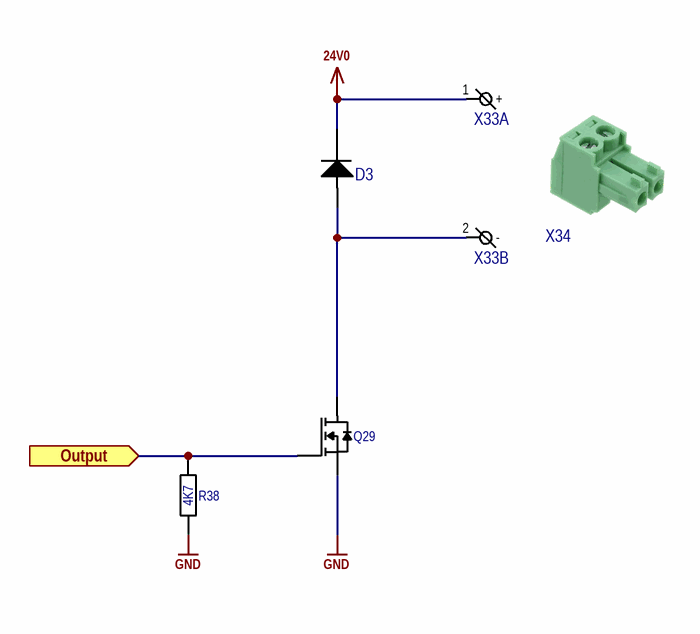
[diagram p15: Output.SchDoc]

### Parts
D3  D  [SOT23-3]  (value not drawn)
Q29  Q  [SOIC-8_MOSFET]  (value not drawn)
R38  value 4K7  [R0603 Reflow]  (hidden comment: R)
X33  X  [691322310002]  (value not drawn)  (parts A,B of 2)
X34  X  [691361300002]  (value not drawn)

### Ports
Output (in)

### Nets
24V0: D3.3(C) X33.1(+)
GND: Q29.2(S) R38.1
Output: Q29.1(G) R38.2 ; port Output
NetD3_1: D3.1(A) Q29.3(D) X33.2(-)

### Channels
Controller/Output: designators end in _1; ports Output=DRV11
Controller/Output: designators end in _2; ports Output=DRV12
Controller/Output: designators end in _3; ports Output=DRV13
Controller/Output: designators end in _4; ports Output=DRV14
Controller/Output: designators end in _5; ports Output=DRV15

### Notes on the sheet
- designed by
- reviewed by
- last drawn by
- Project:
- Schematic:
- last printed
- DIN-A4 L
- sheets
- of
- File:

### Library data of the parts
D3 = HSMS-2800-TR1G: DIODE SCHOTTKY 70V 70MA SOT23-3; 04. Manufacturer: ON Semiconductor; 07. Manufacturer  Part Number: BAS70LT1G; 03. Unit Price: 0.18; 13. Created Date/Name: AUG 2018 / Hören; 01. Distributor: DigiKey; 02. Distributor Part Number: BAS70LT1GOSCT-ND; ComponentLink1Description: Info; ComponentLink1URL: https://www.digikey.de/products/en/discrete-semiconductor-products/diodes-rf/284?k=HSMS-2800&k=&pkeyword=HSMS-2800&sv=0&pv7=243&sf=0&quantity=&ColumnSort=0&page=1&pageSize=25; ComponentLink2Description: DataSheet; ComponentLink2URL: https://docs.broadcom.com/docs/AV02-0533EN
Q29 = AO4266E: Transistor: N-MOSFET; unipolar; 60V; 8,5A; 2W; SO8; 04. Manufacturer: ALPHA & OMEGA SEMICONDUCTOR; 03. Unit Price: 0.242; 01. Distributor: TME; 02. Distributor Part Number: AO4266E; 07. Manufacturer  Part Number: AO4266E; 11. RoHS: YES; ComponentLink1Description: Info; ComponentLink1URL: https://www.digikey.de/product-detail/en/on-semiconductor/FDV303N/FDV303NDKR-ND/1630434; ComponentLink2Description: DataSheet; ComponentLink2URL: https://media.digikey.com/pdf/Data%20Sheets/Fairchild%20PDFs/FDV303N.pdf
R38 = R: as R2-R9 on sheet ADC; Tolerance: ±1%; ComponentLink1URL: *; ComponentLink1Description: Info; 02. Distributor Part Number: 311-4.70KHRCT-ND; 09. Operating Temperature: -xx..+yy°C; 11. RoHS: ???; 01. Distributor: DigiKey; ComponentLink2Description: DataSheet; Package: *
X33 = 691322310002: as X31 on sheet Input; 01. Distributor: DigiKey; 02. Distributor Part Number: 732-2088-ND; 07. Manufacturer  Part Number: 691322310002; 11. RoHS: YES; ComponentLink1Description: Info; ComponentLink1URL: https://www.digikey.de/products/en?keywords=691322310002; ComponentLink2Description: DataSheet; ComponentLink2URL: https://media.digikey.com/pdf/Data%20Sheets/Wurth%20Electronics%20PDFs/Terminal%20Blocks%20WR-TBL.pdf
X34 = 691361300002: as X32 on sheet Input; 01. Distributor: DigiKey; 02. Distributor Part Number: 732-2076-ND; 07. Manufacturer  Part Number: 691361300002; ComponentLink1Description: Info; ComponentLink1URL: https://www.digikey.de/products/en?keywords=691361300002; ComponentLink2Description: DataSheet; ComponentLink2URL: https://media.digikey.com/pdf/Data%20Sheets/Wurth%20Electronics%20PDFs/Terminal%20Blocks%20WR-TBL.pdf